# Altium schematic sheet Sheet4.SchDoc
size A4
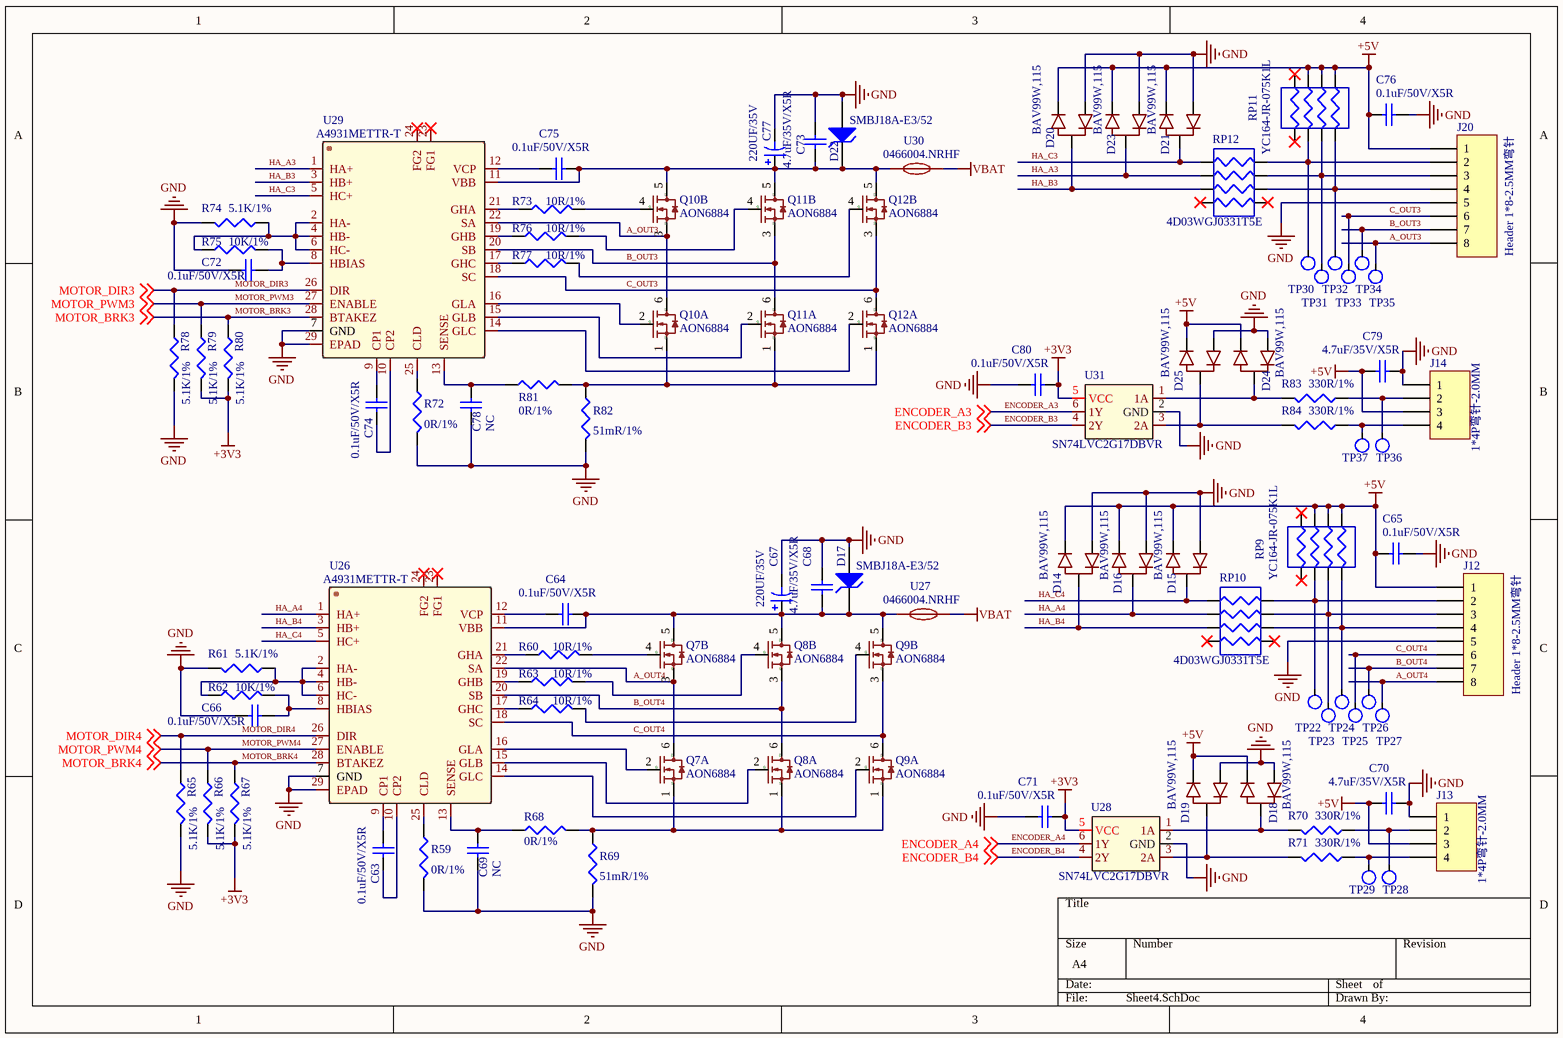
[diagram p0: Sheet4.SchDoc]

## Parts
C63  0.1uF/50V/X5R  [C0603]
C64  0.1uF/50V/X5R  [C0603]
C65  0.1uF/50V/X5R  [C0603]
C66  0.1uF/50V/X5R  [C0603]
C67  220UF/35V  [SMD_8X10.2]
C68  4.7uF/35V/X5R  [C0805]
C69  NC  [C0603]
C70  4.7uF/35V/X5R  [C0603]
C71  0.1uF/50V/X5R  [C0603]
C72  0.1uF/50V/X5R  [C0603]
C73  4.7uF/35V/X5R  [C0805]
C74  0.1uF/50V/X5R  [C0603]
C75  0.1uF/50V/X5R  [C0603]
C76  0.1uF/50V/X5R  [C0603]
C77  220UF/35V  [SMD_8X10.2]
C78  NC  [C0603]
C79  4.7uF/35V/X5R  [C0603]
C80  0.1uF/50V/X5R  [C0603]
D14  BAV99W,115
D15  BAV99W,115
D16  BAV99W,115
D17  SMBJ18A-E3/52  [SMB]
D18  BAV99W,115
D19  BAV99W,115
D20  BAV99W,115
D21  BAV99W,115
D22  SMBJ18A-E3/52  [SMB]
D23  BAV99W,115
D24  BAV99W,115
D25  BAV99W,115
J12  Header 1*8-2.5MM弯针  [DIP_8X2.5]
J13  1*4P弯针-2.0MM  [DIP_4X2MM]
J14  1*4P弯针-2.0MM  [DIP_4X2MM]
J20  Header 1*8-2.5MM弯针  [DIP_8X2.5]
Q7  AON6884  [AOS]  (parts A,B of 2)
Q8  AON6884  [AOS]  (parts A,B of 2)
Q9  AON6884  [AOS]  (parts A,B of 2)
Q10  AON6884  [AOS]  (parts A,B of 2)
Q11  AON6884  [AOS]  (parts A,B of 2)
Q12  AON6884  [AOS]  (parts A,B of 2)
R59  0R/1%  [R0603]
R60  10R/1%  [R0603]
R61  5.1K/1%  [R0603]
R62  10K/1%  [R0603]
R63  10R/1%  [R0603]
R64  10R/1%  [R0603]
R65  5.1K/1%  [R0603]
R66  5.1K/1%  [R0603]
R67  5.1K/1%  [R0603]
R68  0R/1%  [R0603]
R69  51mR/1%  [R0805]
R70  330R/1%  [R0603]
R71  330R/1%  [R0603]
R72  0R/1%  [R0603]
R73  10R/1%  [R0603]
R74  5.1K/1%  [R0603]
R75  10K/1%  [R0603]
R76  10R/1%  [R0603]
R77  10R/1%  [R0603]
R78  5.1K/1%  [R0603]
R79  5.1K/1%  [R0603]
R80  5.1K/1%  [R0603]
R81  0R/1%  [R0603]
R82  51mR/1%  [R0805]
R83  330R/1%  [R0603]
R84  330R/1%  [R0603]
RP9  YC164-JR-075K1L  [RP-1206]
RP10  4D03WGJ0331T5E  [RP-1206]
RP11  YC164-JR-075K1L  [RP-1206]
RP12  4D03WGJ0331T5E  [RP-1206]
TP22  TP  [TP]  (value not drawn)
TP23  TP  [TP]  (value not drawn)
TP24  TP  [TP]  (value not drawn)
TP25  TP  [TP]  (value not drawn)
TP26  TP  [TP]  (value not drawn)
TP27  TP  [TP]  (value not drawn)
TP28  TP  [TP]  (value not drawn)
TP29  TP  [TP]  (value not drawn)
TP30  TP  [TP]  (value not drawn)
TP31  TP  [TP]  (value not drawn)
TP32  TP  [TP]  (value not drawn)
TP33  TP  [TP]  (value not drawn)
TP34  TP  [TP]  (value not drawn)
TP35  TP  [TP]  (value not drawn)
TP36  TP  [TP]  (value not drawn)
TP37  TP  [TP]  (value not drawn)
U26  A4931METTR-T  [QFN-28]
U27  0466004.NRHF  [1206]
U28  SN74LVC2G17DBVR  [SOT-23-6]
U29  A4931METTR-T  [QFN-28]
U30  0466004.NRHF  [1206]
U31  SN74LVC2G17DBVR  [SOT-23-6]

## Nets
+3V3: C71.1 C80.1 R66.2 R67.2 R79.2 R80.2 U28.5(VCC) U31.5(VCC)
+5V: C65.1 C70.1 C76.1 C79.1 D14.2 D15.2 D16.2 D18.2 D19.2 D20.2 D21.2 D23.2 D24.2 D25.2 J12.1 J13.3 J14.3 J20.1 RP9.1 RP9.2 RP9.3 RP11.1 RP11.2 RP11.3
GND: C65.2 C66.1 C67.2 C68.2 C69.2 C70.2 C71.2 C72.2 C73.2 C76.2 C77.2 C78.2 C79.2 C80.2 D14.1 D15.1 D16.1 D17.1(A) D18.1 D19.1 D20.1 D21.1 D22.1(A) D23.1 D24.1 D25.1 J12.5 J13.1 J14.1 J20.5 R59.2 R61.2 R65.2 R69.2 R72.2 R74.2 R78.2 R82.2 U26.7(GND) U26.29(EPAD) U28.2(GND) U29.7(GND) U29.29(EPAD) U31.2(GND)
VBAT: U27.2 U30.1
A_OUT3: J20.8 Q10.3(S) Q10.6 TP35.1 U29.22(SA)
A_OUT4: J12.8 Q7.3(S) Q7.6 TP27.1 U26.22(SA)
B_OUT3: J20.7 Q11.3(S) Q11.6 TP34.1 U29.20(SB)
B_OUT4: J12.7 Q8.3(S) Q8.6 TP26.1 U26.20(SB)
C_OUT3: J20.6 Q12.3(S) Q12.6 TP33.1 U29.18(SC)
C_OUT4: J12.6 Q9.3(S) Q9.6 TP25.1 U26.18(SC)
ENCODER_A3: U31.6(1Y) ; off-sheet ENCODER_A3
ENCODER_A4: U28.6(1Y) ; off-sheet ENCODER_A4
ENCODER_B3: U31.4(2Y) ; off-sheet ENCODER_B3
ENCODER_B4: U28.4(2Y) ; off-sheet ENCODER_B4
HA_A3: D23.3 RP12.2 U29.1(HA+)
HA_A4: D16.3 RP10.2 U26.1(HA+)
HA_B3: D20.3 RP12.3 U29.3(HB+)
HA_B4: D14.3 RP10.3 U26.3(HB+)
HA_C3: D21.3 RP12.1 U29.5(HC+)
HA_C4: D15.3 RP10.1 U26.5(HC+)
MOTOR_BRK3: R80.1 U29.28(BTAKEZ) ; off-sheet MOTOR_BRK3
MOTOR_BRK4: R67.1 U26.28(BTAKEZ) ; off-sheet MOTOR_BRK4
MOTOR_DIR3: R78.1 U29.26(DIR) ; off-sheet MOTOR_DIR3
MOTOR_DIR4: R65.1 U26.26(DIR) ; off-sheet MOTOR_DIR4
MOTOR_PWM3: R79.1 U29.27(ENABLE) ; off-sheet MOTOR_PWM3
MOTOR_PWM4: R66.1 U26.27(ENABLE) ; off-sheet MOTOR_PWM4
NetC63_1: C63.1 U26.9(CP1)
NetC63_2: C63.2 U26.10(CP2)
NetC64_1: C64.1 U26.12(VCP)
NetC64_2: C64.2 C67.1 C68.1 D17.2(K) Q7.5(D) Q8.5(D) Q9.5(D) U26.11(VBB) U27.1
NetC66_2: C66.2 R62.2 U26.8(HBIAS)
NetC69_1: C69.1 R68.1 U26.13(SENSE)
NetC72_1: C72.1 R75.2 U29.8(HBIAS)
NetC73_1: C73.1 C75.2 C77.1 D22.2(K) Q10.5(D) Q11.5(D) Q12.5(D) U29.11(VBB) U30.2
NetC74_1: C74.1 U29.9(CP1)
NetC74_2: C74.2 U29.10(CP2)
NetC75_1: C75.1 U29.12(VCP)
NetC78_1: C78.1 R81.1 U29.13(SENSE)
NetD18_3: D18.3 R70.2 U28.1(1A)
NetD19_3: D19.3 R71.2 U28.3(2A)
NetD24_3: D24.3 R83.2 U31.1(1A)
NetD25_3: D25.3 R84.2 U31.3(2A)
NetJ12_2: J12.2 RP9.6 RP10.8 TP22.1
NetJ12_3: J12.3 RP9.7 RP10.7 TP23.1
NetJ12_4: J12.4 RP9.8 RP10.6 TP24.1
NetJ13_2: J13.2 R70.1 TP28.1
NetJ13_4: J13.4 R71.1 TP29.1
NetJ14_2: J14.2 R83.1 TP36.1
NetJ14_4: J14.4 R84.1 TP37.1
NetJ20_2: J20.2 RP11.6 RP12.8 TP30.1
NetJ20_3: J20.3 RP11.7 RP12.7 TP31.1
NetJ20_4: J20.4 RP11.8 RP12.6 TP32.1
NetQ7_1: Q7.1(S) Q8.1(S) Q9.1(S) R68.2 R69.1
NetQ7_2: Q7.2(G) U26.16(GLA)
NetQ7_4: Q7.4(G) R60.2
NetQ8_2: Q8.2(G) U26.15(GLB)
NetQ8_4: Q8.4(G) R63.2
NetQ9_2: Q9.2(G) U26.14(GLC)
NetQ9_4: Q9.4(G) R64.2
NetQ10_1: Q10.1(S) Q11.1(S) Q12.1(S) R81.2 R82.1
NetQ10_2: Q10.2(G) U29.16(GLA)
NetQ10_4: Q10.4(G) R73.2
NetQ11_2: Q11.2(G) U29.15(GLB)
NetQ11_4: Q11.4(G) R76.2
NetQ12_2: Q12.2(G) U29.14(GLC)
NetQ12_4: Q12.4(G) R77.2
NetR59_1: R59.1 U26.25(CLD)
NetR60_1: R60.1 U26.21(GHA)
NetR61_1: R61.1 R62.1 U26.2(HA-) U26.4(HB-) U26.6(HC-)
NetR63_1: R63.1 U26.19(GHB)
NetR64_1: R64.1 U26.17(GHC)
NetR72_1: R72.1 U29.25(CLD)
NetR73_1: R73.1 U29.21(GHA)
NetR74_1: R74.1 R75.1 U29.2(HA-) U29.4(HB-) U29.6(HC-)
NetR76_1: R76.1 U29.19(GHB)
NetR77_1: R77.1 U29.17(GHC)

Not connected (* = marked no-connect by the designer): RP9 4* 5*; RP10 4* 5*; RP11 4* 5*; RP12 4* 5*; U26 23(FG1)* 24(FG2)*; U29 23(FG1)* 24(FG2)*

## Library data of the parts
C63-C66 C68-C76 C78-C80 = Cap Semi: Capacitor (Semiconductor SIM Model); Value: 100pF; Published: 8-Jun-2000; LatestRevisionDate: 29-May-2009; LatestRevisionNote: IPC-7351 Footprint Added.; PackageReference: C1206; Publisher: Altium Limited; PackageDescription: Chip Capacitor
C67 C77 = Cap Pol1: Polarized Capacitor (Radial); Value: 100pF; Published: 8-Jun-2000; LatestRevisionDate: 17-Jul-2002; LatestRevisionNote: Re-released for DXP Platform.; PackageReference: RB7.6-15; Publisher: Altium Limited; PackageDescription: Polarized Capacitor (Radial); 2 Leads
D17 D22 = D Zener: Zener Diode; Published: 8-Jun-2000; LatestRevisionDate: 17-Jul-2002; LatestRevisionNote: Re-released for DXP Platform.; PackageReference: DIODE-0.7; Publisher: Altium Limited; PackageDescription: Diode, Thru-Hole; 2 Leads; 0.7 in Pin Spacing
J12 J20 = Header 8: Header, 8-Pin; LatestRevisionDate: 17-Jul-2002; LatestRevisionNote: Re-released for DXP Platform.; Publisher: Altium Limited
J13 J14 = Header 4: Header, 4-Pin; LatestRevisionDate: 17-Jul-2002; LatestRevisionNote: Re-released for DXP Platform.; Publisher: Altium Limited
R59-R84 = Res3: Resistor; Value: 1K; Published: 8-Jun-2000; LatestRevisionDate: 29-May-2009; LatestRevisionNote: IPC-7351 Footprint Added.; PackageReference: J1-0603; Publisher: Altium Limited; PackageDescription: Chip Resistor
RP9-RP12 = RP